# Altium schematic sheet Aixcel_Tiny_Recon_Board_Page2.SchDoc
size A4; Organization: Altium Limited; Address1: L3, 12a Rodborough Rd; Address2: Frenchs Forest; Address3: NSW; DocumentNumber: 01; Revision: 01; SheetNumber: 4; SheetTotal: 4
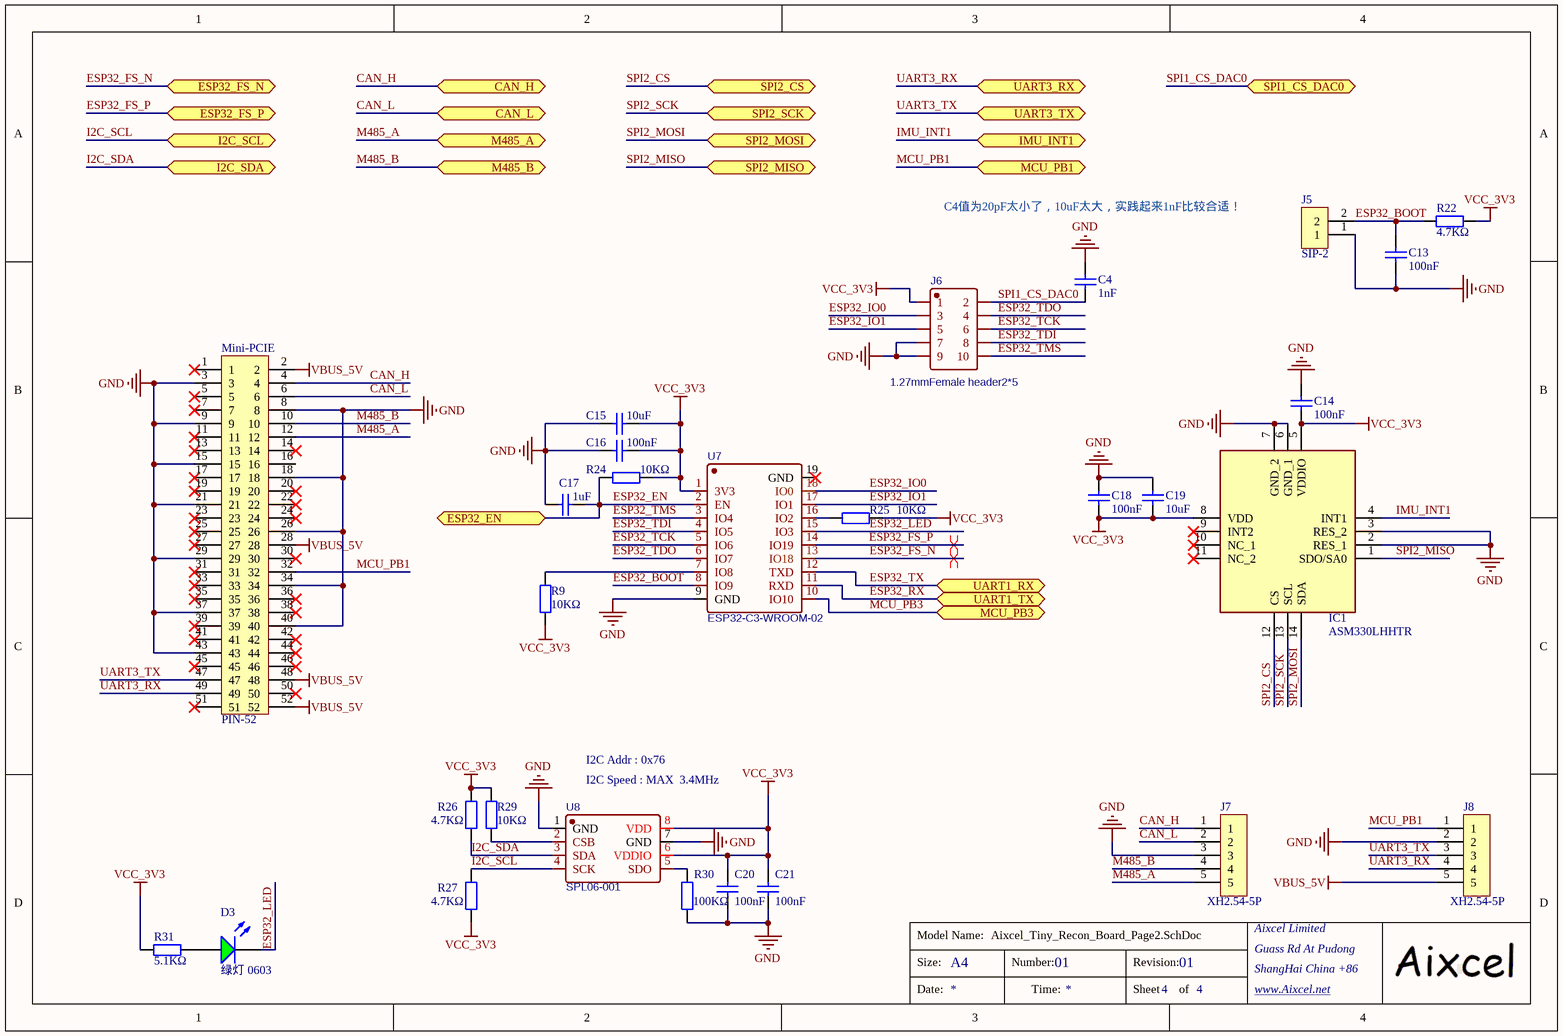
[diagram p0: Aixcel_Tiny_Recon_Board_Page2.SchDoc]

## Parts
C4  1nF  [0603_C]
C13  100nF  [0603_C]
C14  100nF  [0603_C]
C15  10uF  [0603_C]
C16  100nF  [0603_C]
C17  1uF  [0603_C]
C18  100nF  [0603_C]
C19  10uF  [0603_C]
C20  100nF  [0603_C]
C21  100nF  [0603_C]
D3  绿灯 0603  [0603_LED_S1]
IC1  ASM330LHHTR  [LGA-14(2.5X3X0.86)]
J5  SIP-2  [TSW SMD-3*6*2.5]
J6  1.27mmFemale header2*5  [1.27mm_2_5排母]
J7  XH2.54-5P  [2.54XH接插件5P]
J8  XH2.54-5P  [2.54XH接插件5P]
Mini-PCIE  PIN-52  [PCBComponent_1]
R9  10KΩ  [0603_R]
R22  4.7KΩ  [0603_R]
R24  10KΩ  [0603_R]
R25  10KΩ  [0603_R]
R26  4.7KΩ  [0603_R]
R27  4.7KΩ  [0603_R]
R29  10KΩ  [0603_R]
R30  100KΩ  [0603_R]
R31  5.1KΩ  [0603_R]
U7  ESP32-C3-WROOM-02  [WIFIM-SMD_19P-L18.0-W20.0-P1.50]
U8  SPL06-001  [SPL06-001]

## Ports
CAN_H (bidir), CAN_L (bidir), ESP32_EN (bidir), ESP32_FS_N (bidir), ESP32_FS_P (bidir), I2C_SCL (bidir), I2C_SDA (bidir), IMU_INT1 (bidir), M485_A (bidir), M485_B (bidir), MCU_PB1 (bidir), MCU_PB3 (bidir), SPI1_CS_DAC0 (bidir), SPI2_CS (bidir), SPI2_MISO (bidir), SPI2_MOSI (bidir), SPI2_SCK (bidir), UART1_RX (bidir), UART1_TX (bidir), UART3_RX (bidir), UART3_TX (bidir)

## Nets
GND: C4.2 C13.1 C14.2 C15.2 C16.2 C17.2 C18.2 C19.2 C20.1 C21.1 IC1.2(RES_1) IC1.3(RES_2) IC1.6(GND_1) IC1.7(GND_2) J5.1 J6.7 J6.9 J7.3 J8.2 Mini-PCIE.3 Mini-PCIE.8 Mini-PCIE.9 Mini-PCIE.15 Mini-PCIE.18 Mini-PCIE.21 Mini-PCIE.26 Mini-PCIE.29 Mini-PCIE.34 Mini-PCIE.37 Mini-PCIE.40 Mini-PCIE.43 R30.1 U7.9(GND) U8.1(GND) U8.7(GND)
VBUS_5V: J8.5 Mini-PCIE.2 Mini-PCIE.28 Mini-PCIE.48 Mini-PCIE.52
VCC_3V3: C14.1 C15.1 C16.1 C18.1 C19.1 C20.2 C21.2 IC1.5(VDDIO) IC1.8(VDD) J6.1 R9.1 R22.2 R24.2 R25.2 R26.2 R27.1 R29.2 R31.1 U7.1(3V3) U8.6(VDDIO) U8.8(VDD)
CAN_H: J7.1 Mini-PCIE.4 ; port CAN_H
CAN_L: J7.2 Mini-PCIE.6 ; port CAN_L
ESP32_BOOT: C13.2 J5.2 R22.1 U7.8(IO9)
ESP32_EN: C17.1 R24.1 U7.2(EN) ; port ESP32_EN
ESP32_FS_N: U7.13(IO18) ; port ESP32_FS_N
ESP32_FS_P: U7.14(IO19) ; port ESP32_FS_P
ESP32_IO0: J6.3 U7.18(IO0)
ESP32_IO1: J6.5 U7.17(IO1)
ESP32_LED: D3.K U7.15(IO3)
ESP32_RX: U7.11(RXD) ; port UART1_TX
ESP32_TCK: J6.6 U7.5(IO6)
ESP32_TDI: J6.8 U7.4(IO5)
ESP32_TDO: J6.4 U7.6(IO7)
ESP32_TMS: J6.10 U7.3(IO4)
ESP32_TX: U7.12(TXD) ; port UART1_RX
I2C_SCL: R27.2 U8.4(SCK) ; port I2C_SCL
I2C_SDA: R26.1 U8.3(SDA) ; port I2C_SDA
IMU_INT1: IC1.4(INT1) ; port IMU_INT1
M485_A: J7.5 Mini-PCIE.12 ; port M485_A
M485_B: J7.4 Mini-PCIE.10 ; port M485_B
MCU_PB1: J8.1 Mini-PCIE.32 ; port MCU_PB1
MCU_PB3: U7.10(IO10) ; port MCU_PB3
SPI1_CS_DAC0: C4.1 J6.2 ; port SPI1_CS_DAC0
SPI2_CS: IC1.12(CS) ; port SPI2_CS
SPI2_MISO: IC1.1(SDO/SA0) ; port SPI2_MISO
SPI2_MOSI: IC1.14(SDA) ; port SPI2_MOSI
SPI2_SCK: IC1.13(SCL) ; port SPI2_SCK
UART3_RX: J8.4 Mini-PCIE.49 ; port UART3_RX
UART3_TX: J8.3 Mini-PCIE.47 ; port UART3_TX
NetD3_A: D3.A R31.2
NetR9_2: R9.2 U7.7(IO8)
NetR25_1: R25.1 U7.16(IO2)
NetR29_1: R29.1 U8.2(CSB)
NetR30_2: R30.2 U8.5(SDO)

Not connected (* = marked no-connect by the designer): IC1 9(INT2)* 10(NC_1)* 11(NC_2)*; Mini-PCIE 1* 5* 7* 11* 13* 14* 16 17* 19* 20* 22* 23* 24* 25* 27* 30* 31* 33* 35* 36* 38* 39* 41* 42* 44* 45* 46* 50* 51*; U7 19(GND)*

## Layout directives
differential pair: ESP32_FS_N, ESP32_FS_P

## Notes on the sheet
- C4值为20pF太小了，10uF太大，实践起来1nF比较合适！
- I2C Addr : 0x76
- (near U8) I2C Speed : MAX  3.4MHz
- Size:
- Model Name:
- A4
- Number:
- Revision:
- Aixcel Limited
- Guass Rd At Pudong
- ShangHai China +86
- Date:
- Time:
- Sheet
- of
- www.Aixcel.net <http://www.Aixcel.net>

## Library data of the parts
C4 = 0603 1nF (102) 10% 50V: 贴片电容; ComponentLink1Description: 供应商链接; ComponentLink1URL: http://www.szlcsc.com/product/details_1940.html; Package: 0603; Supplier: LC; SuppliersPartNumber: C1588
C13 C14 C16 C18 C20 C21 = 0603 100nF (104) 10% 50V: 贴片电容; ComponentLink1Description: 供应商链接; ComponentLink1URL: http://www.szlcsc.com/product/details_15331.html; Package: 0603; Supplier: LC; SuppliersPartNumber: C14663
C15 C19 = 0603 10uF (106) 10% 10V: 贴片电容; ComponentLink1Description: 供应商链接; ComponentLink1URL: http://www.szlcsc.com/product/details_20411.html; Package: 0603; Supplier: LC; SuppliersPartNumber: C19702
C17 = 0603 1uF (105) 10% 50V: 贴片电容; ComponentLink1Description: 供应商链接; ComponentLink1URL: http://www.szlcsc.com/product/details_16531.html; Package: 0603; Supplier: LC; SuppliersPartNumber: C15849
D3 = 0603 绿灯: 发光二极管; ComponentLink1Description: 供应商链接; ComponentLink1URL: http://www.szlcsc.com/product/details_73152.html; Package: 0603; Supplier: LC; SuppliersPartNumber: C72043
IC1 = ASM330LHHTR: Integrated Circuit; Manufacturer_Name: STMicroelectronics; Datasheet Link: https://www.st.com/resource/en/datasheet/asm330lhh.pdf; Mouser2 Part Number: 511-ASM330LHHTR; Mouser2 Price/Stock: https://www.mouser.com/Search/Refine.aspx?Keyword=511-ASM330LHHTR; Manufacturer_Part_Number: ASM330LHHTR
J6 = 1.27mmFemale header2*5: BOM_Manufacturer: BOOMELE; BOM_Supplier: LCSC; BOM_Manufacturer Part: 1.27mmFemale header2*5; BOM_Supplier Part: C59983; BOM_JLCPCB Part Class: Extended Part; spicePre: H; spiceSymbolName: 1.27mmFemale header2*5
J7 J8 = SIP-5
R9 R24 R25 R29 = 0603 10KΩ (1002) 1%: 贴片电阻; ComponentLink1Description: 供应商链接; ComponentLink1URL: http://www.szlcsc.com/product/details_26547.html; Package: 0603; Supplier: LC; SuppliersPartNumber: C25804
R22 R26 R27 = 0603 4.7KΩ (4701) 1%: 贴片电阻; ComponentLink1Description: 供应商链接; ComponentLink1URL: http://www.szlcsc.com/product/details_23889.html; Package: 0603; Supplier: LC; SuppliersPartNumber: C23162
R30 = 0603 100KΩ (1003) 1%: 贴片电阻; ComponentLink1Description: 供应商链接; ComponentLink1URL: http://www.szlcsc.com/product/details_26546.html; Package: 0603; Supplier: LC; SuppliersPartNumber: C25803
R31 = 0603 5.1KΩ (5101) 1%: 贴片电阻; ComponentLink1Description: 供应商链接; ComponentLink1URL: http://www.szlcsc.com/product/details_23913.html; Package: 0603; Supplier: LC; SuppliersPartNumber: C23186
U7 = ESP-C3-WROOM-02: BOM_Manufacturer: Espressif Systems; BOM_Manufacturer Part: ESP-WROOM-02D(4MB); Contributor: LCSC; BOM_Supplier: LCSC; BOM_Supplier Part: C529584; BOM_JLCPCB Part Class: Extended Part; spicePre: U; spiceSymbolName: ESP-WROOM-02D(4MB)
U8 = SPL06-001: BOM_Manufacturer: Goertek(歌尔); Contributor: LCSC; BOM_Supplier: LCSC; BOM_Supplier Part: C2684428; BOM_Manufacturer Part: SPL06-001; BOM_JLCPCB Part Class: Extended Part; spicePre: U; spiceSymbolName: SPL06-001